# Altium schematic sheet WS2812_MATRIX_8.SchDoc
size A4
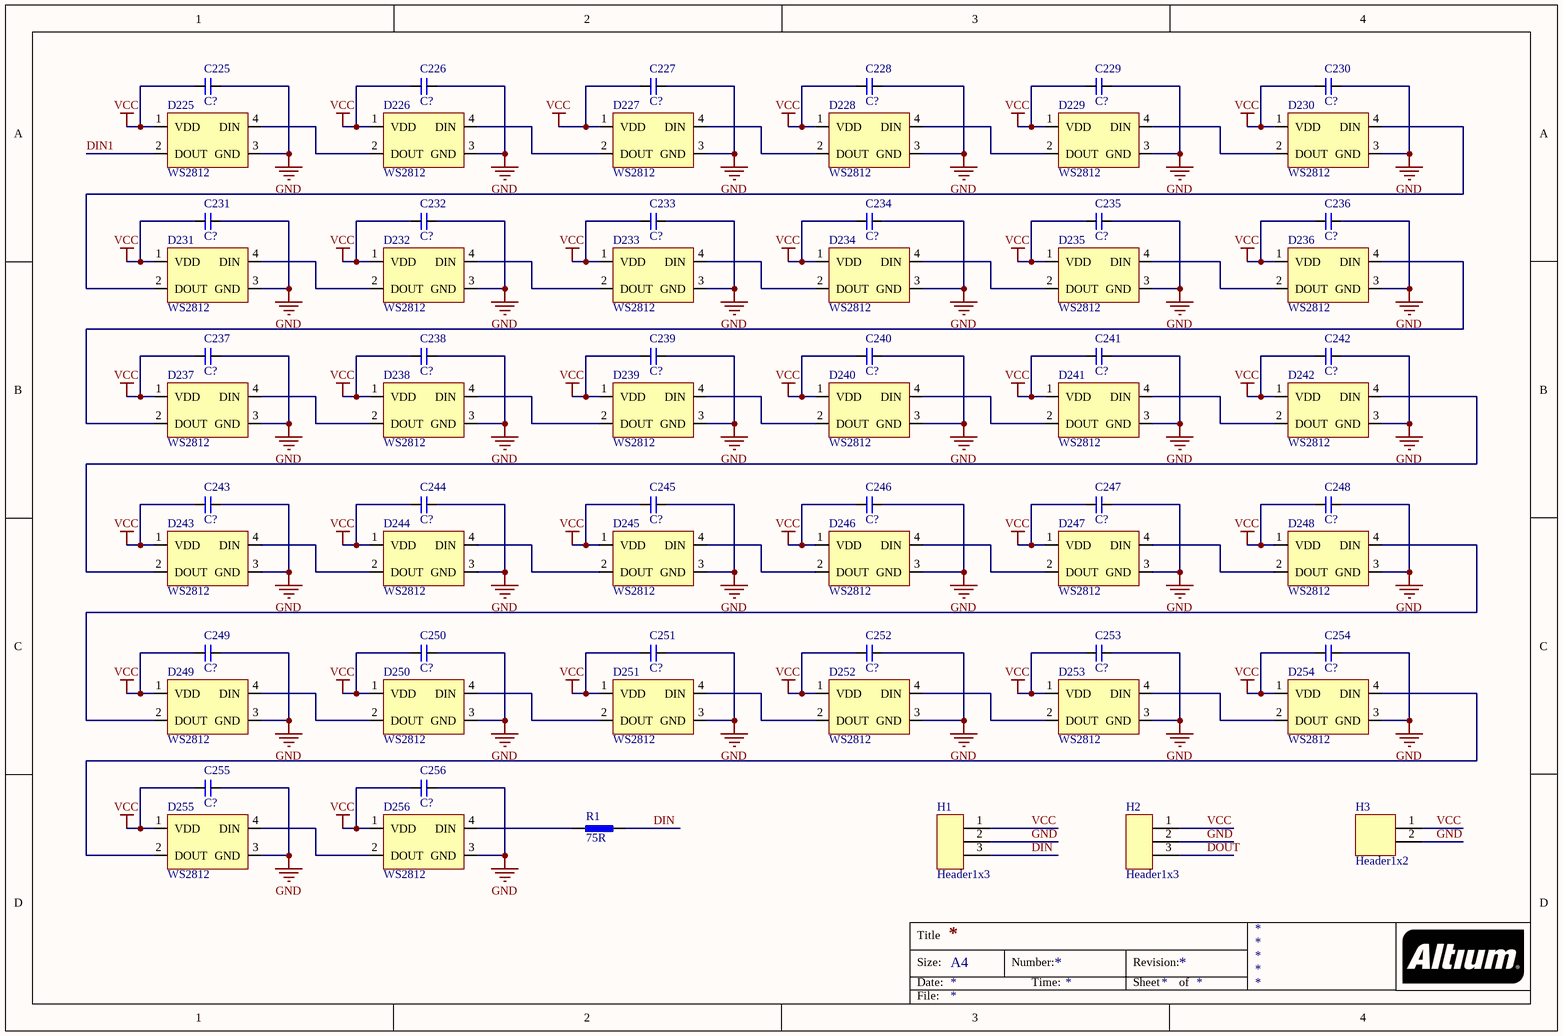
[diagram p0: WS2812_MATRIX_8.SchDoc]

## Parts
C225  C?  [C0603]
C226  C?  [C0603]
C227  C?  [C0603]
C228  C?  [C0603]
C229  C?  [C0603]
C230  C?  [C0603]
C231  C?  [C0603]
C232  C?  [C0603]
C233  C?  [C0603]
C234  C?  [C0603]
C235  C?  [C0603]
C236  C?  [C0603]
C237  C?  [C0603]
C238  C?  [C0603]
C239  C?  [C0603]
C240  C?  [C0603]
C241  C?  [C0603]
C242  C?  [C0603]
C243  C?  [C0603]
C244  C?  [C0603]
C245  C?  [C0603]
C246  C?  [C0603]
C247  C?  [C0603]
C248  C?  [C0603]
C249  C?  [C0603]
C250  C?  [C0603]
C251  C?  [C0603]
C252  C?  [C0603]
C253  C?  [C0603]
C254  C?  [C0603]
C255  C?  [C0603]
C256  C?  [C0603]
D225  WS2812  [WS2812_3528]
D226  WS2812  [WS2812_3528]
D227  WS2812  [WS2812_3528]
D228  WS2812  [WS2812_3528]
D229  WS2812  [WS2812_3528]
D230  WS2812  [WS2812_3528]
D231  WS2812  [WS2812_3528]
D232  WS2812  [WS2812_3528]
D233  WS2812  [WS2812_3528]
D234  WS2812  [WS2812_3528]
D235  WS2812  [WS2812_3528]
D236  WS2812  [WS2812_3528]
D237  WS2812  [WS2812_3528]
D238  WS2812  [WS2812_3528]
D239  WS2812  [WS2812_3528]
D240  WS2812  [WS2812_3528]
D241  WS2812  [WS2812_3528]
D242  WS2812  [WS2812_3528]
D243  WS2812  [WS2812_3528]
D244  WS2812  [WS2812_3528]
D245  WS2812  [WS2812_3528]
D246  WS2812  [WS2812_3528]
D247  WS2812  [WS2812_3528]
D248  WS2812  [WS2812_3528]
D249  WS2812  [WS2812_3528]
D250  WS2812  [WS2812_3528]
D251  WS2812  [WS2812_3528]
D252  WS2812  [WS2812_3528]
D253  WS2812  [WS2812_3528]
D254  WS2812  [WS2812_3528]
D255  WS2812  [WS2812_3528]
D256  WS2812  [WS2812_3528]
H1  Header1x3  [HDR1X3_2.54_NO_HOLE]
H2  Header1x3  [HDR1X3_2.54_NO_HOLE]
H3  Header1x2  [BATIN]
R1  75R  [R0603]

## Nets
GND: C225.2 C226.2 C227.2 C228.2 C229.2 C230.2 C231.2 C232.2 C233.2 C234.2 C235.2 C236.2 C237.2 C238.2 C239.2 C240.2 C241.2 C242.2 C243.2 C244.2 C245.2 C246.2 C247.2 C248.2 C249.2 C250.2 C251.2 C252.2 C253.2 C254.2 C255.2 C256.2 D225.3(GND) D226.3(GND) D227.3(GND) D228.3(GND) D229.3(GND) D230.3(GND) D231.3(GND) D232.3(GND) D233.3(GND) D234.3(GND) D235.3(GND) D236.3(GND) D237.3(GND) D238.3(GND) D239.3(GND) D240.3(GND) D241.3(GND) D242.3(GND) D243.3(GND) D244.3(GND) D245.3(GND) D246.3(GND) D247.3(GND) D248.3(GND) D249.3(GND) D250.3(GND) D251.3(GND) D252.3(GND) D253.3(GND) D254.3(GND) D255.3(GND) D256.3(GND) H1.2 H2.2 H3.2
VCC: C225.1 C226.1 C227.1 C228.1 C229.1 C230.1 C231.1 C232.1 C233.1 C234.1 C235.1 C236.1 C237.1 C238.1 C239.1 C240.1 C241.1 C242.1 C243.1 C244.1 C245.1 C246.1 C247.1 C248.1 C249.1 C250.1 C251.1 C252.1 C253.1 C254.1 C255.1 C256.1 D225.1(VDD) D226.1(VDD) D227.1(VDD) D228.1(VDD) D229.1(VDD) D230.1(VDD) D231.1(VDD) D232.1(VDD) D233.1(VDD) D234.1(VDD) D235.1(VDD) D236.1(VDD) D237.1(VDD) D238.1(VDD) D239.1(VDD) D240.1(VDD) D241.1(VDD) D242.1(VDD) D243.1(VDD) D244.1(VDD) D245.1(VDD) D246.1(VDD) D247.1(VDD) D248.1(VDD) D249.1(VDD) D250.1(VDD) D251.1(VDD) D252.1(VDD) D253.1(VDD) D254.1(VDD) D255.1(VDD) D256.1(VDD) H1.1 H2.1 H3.1
DIN: H1.3 R1.2
DIN1: D225.2(DOUT)
DOUT: H2.3
NetD225_4: D225.4(DIN) D226.2(DOUT)
NetD226_4: D226.4(DIN) D227.2(DOUT)
NetD227_4: D227.4(DIN) D228.2(DOUT)
NetD228_4: D228.4(DIN) D229.2(DOUT)
NetD229_4: D229.4(DIN) D230.2(DOUT)
NetD230_4: D230.4(DIN) D231.2(DOUT)
NetD231_4: D231.4(DIN) D232.2(DOUT)
NetD232_4: D232.4(DIN) D233.2(DOUT)
NetD233_4: D233.4(DIN) D234.2(DOUT)
NetD234_4: D234.4(DIN) D235.2(DOUT)
NetD235_4: D235.4(DIN) D236.2(DOUT)
NetD236_4: D236.4(DIN) D237.2(DOUT)
NetD237_4: D237.4(DIN) D238.2(DOUT)
NetD238_4: D238.4(DIN) D239.2(DOUT)
NetD239_4: D239.4(DIN) D240.2(DOUT)
NetD240_4: D240.4(DIN) D241.2(DOUT)
NetD241_4: D241.4(DIN) D242.2(DOUT)
NetD242_4: D242.4(DIN) D243.2(DOUT)
NetD243_4: D243.4(DIN) D244.2(DOUT)
NetD244_4: D244.4(DIN) D245.2(DOUT)
NetD245_4: D245.4(DIN) D246.2(DOUT)
NetD246_4: D246.4(DIN) D247.2(DOUT)
NetD247_4: D247.4(DIN) D248.2(DOUT)
NetD248_4: D248.4(DIN) D249.2(DOUT)
NetD249_4: D249.4(DIN) D250.2(DOUT)
NetD250_4: D250.4(DIN) D251.2(DOUT)
NetD251_4: D251.4(DIN) D252.2(DOUT)
NetD252_4: D252.4(DIN) D253.2(DOUT)
NetD253_4: D253.4(DIN) D254.2(DOUT)
NetD254_4: D254.4(DIN) D255.2(DOUT)
NetD255_4: D255.4(DIN) D256.2(DOUT)
NetD256_4: D256.4(DIN) R1.1

## Notes on the sheet
- Title
- Size:
- Date:
- A4
- Number:
- Time:
- Revision:
- Sheet
- of
- File:

## Library data of the parts
C225-C256 = CAP
R1 = RES